# EAGLE design scienceWing (EAGLE 6.6.0)
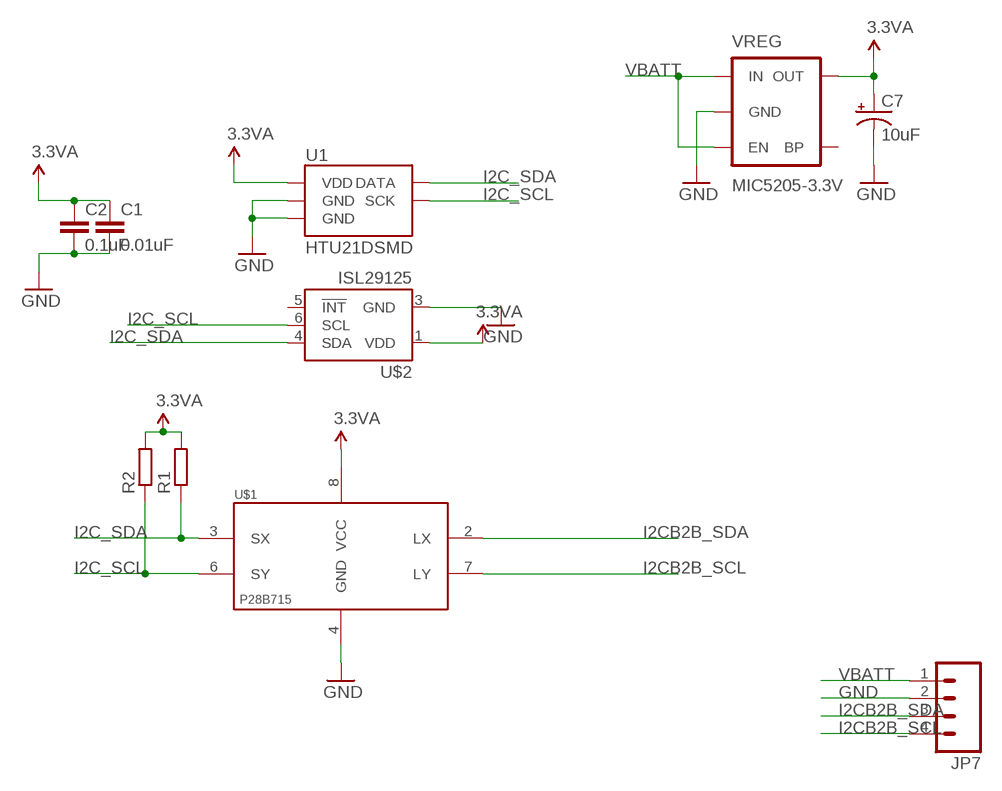
[diagram p0: schematic, sheet 1]

## Parts
C1  0.01uF  C0603  [C0603]
C2  0.1uF  C0603  [C0603]
C7  10uF  CAP_POL1206  [EIA3216]
JP7  M04JST  [1X04-1.5MM_JST]
R1  R0603  [R0603]
R2  R0603  [R0603]
U1  HTU21DSMD  [HTU21D]
U$1  P82B715  [SO8]
U$2  ISL29125  [ODFN-LD-6]
VREG  MIC5205-3.3V  V_REG_LDOSMD  [SOT23-5]

## Nets
GND: C1.2 C2.2 C7.C(-) JP7.2 U1.7(GND) U1.GND U$1.4(GND) U$2.3(GND) VREG.2(GND)
I2C_SCL: R2.1 U1.SCK U$1.6(SY) U$2.6(SCL)
I2C_SDA: R1.1 U1.DATA U$1.3(SX) U$2.4(SDA)
I2CB2B_SCL: JP7.4 U$1.7(LY)
I2CB2B_SDA: JP7.3 U$1.2(LX)
VBATT: JP7.1 VREG.1(IN) VREG.3(EN)
VCC: C1.1 C2.1 C7.A(+) R1.2 R2.2 U1.VDD U$1.8(VCC) U$2.1(VDD) VREG.5(OUT) ; supply symbol labelled 3.3VA
Unconnected: U$2.5(!INT) VREG.4(BP)

## Library data of the parts
C1 C2 = ELL-i-Passives:C: Surface Mount Capasitors — in standard sizes A capacitor used to store energy electrostatically in an electric field. If you need a high-value capacitor, consider using a polarised capacitor to save space. Wikipedia article on capacitors <https://en.wikipedia.org/wiki/Capacitor>
C7 = SparkFun-Capacitors:CAP_POL: Capacitor Polarized These are standard SMD and PTH capacitors. Normally 10uF, 47uF, and 100uF in electrolytic and tantalum varieties. Always verify the external diameter of the through hole cap, it varies with capacity, voltage, and manufacturer. The EIA devices should be standard.
JP7 = SparkFun-Connectors:M04: Header 4 Standard 4-pin 0.1" header. Use with straight break away headers (SKU : PRT-00116), right angle break away headers (PRT-00553), swiss pins (PRT-00743), machine pins (PRT-00117), and female headers (PRT-00115). Molex polarized connector foot print use with SKU : PRT-08231 with associated crimp pins and housings. 1MM SMD Version SKU: PRT-10208; OC_NEWARK: unknown
R1 R2 = ELL-i-Passives:R: Surface Mount Resistor — in standard sizes
U1 = SparkFun-Sensors:HTU21D
U$1 = Sensors:P82B715
U$2 = SparkFun-Sensors:ISL29125: The ISL29125 is a low power, high sensitivity RGB color light sensor with an I2C interface.
VREG = SparkFun:V_REG_LDO: Voltage Regulator LDO Standard 150mA LDO voltage regulator in SOT-23 layout. Micrel part MIC5205. BP (by-pass) pin is used to lower output noise with 470pF cap.

## Board
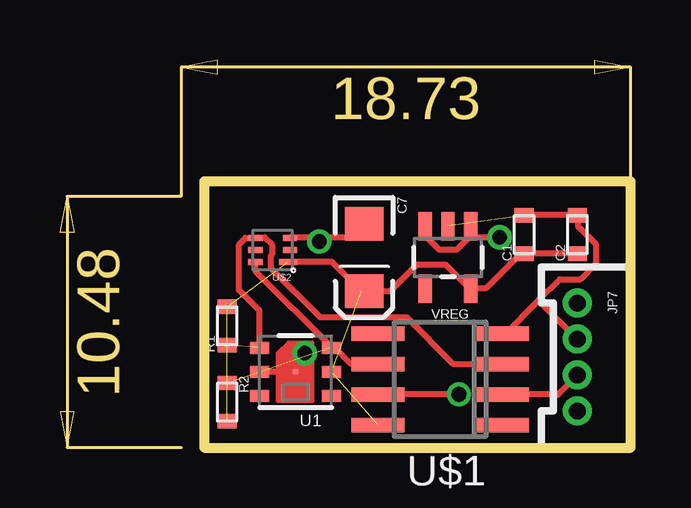
[diagram p1: board, top side]
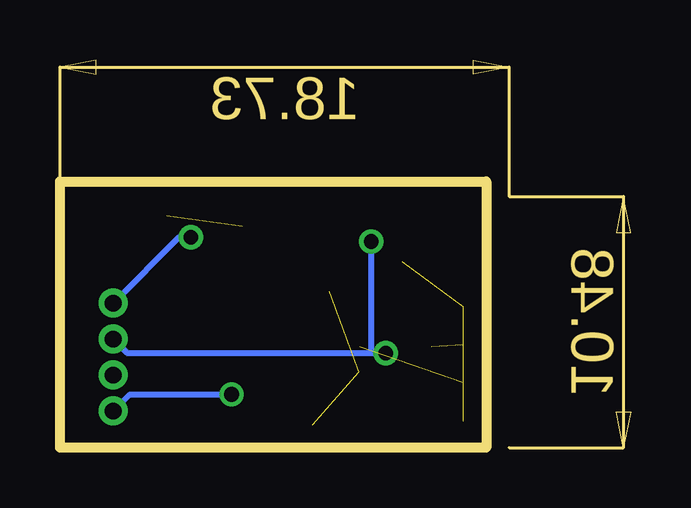
[diagram p2: board, bottom side, seen from below]

Size 17.78 x 11.11 mm. Coordinates in mm from the lower left corner, seen from the top.
Outline: 0,0 17.78,0 17.78,11.11 0,11.11 0,0
Copper layers (1*16): Top 0.035mm / dielectric 1.5mm / Bottom 0.035mm
Design rules "default": minimum track width 10mil, minimum drill 24mil, track to track 8mil, track to pad 8mil, pad to pad 8mil, via to via 8mil, smd to smd 8mil, copper to edge 40mil, drill to drill 8mil, minimum pad ring 10mil, minimum via ring 8mil, stop-mask expansion 4mil, vias tented up to drill 0mil, thermal gap 10mil

### Footprints (pad centres in the part's own frame; a part is rotated, then mirrored left to right if it is on the bottom)
C0603 = smd 0.6 x 0.8: 1 -0.8,0; 2 0.8,0
EIA3216 = smd 1.4 x 1.6: A 1.4,0; C -1.4,0
1X04-1.5MM_JST = drill 0.7: 1 0,0; 2 1.5,0; 3 3,0; 4 4.5,0
R0603 = smd 0.6 x 0.8: 1 -0.8,0; 2 0.8,0
HTU21D = smd 0.2 x 0.2: 7 0,0 | smd 0.8 x 0.5: DATA 1.5,-1; GND 1.5,0; NC@1 -1.5,1; NC@6 1.5,1; SCK -1.5,-1; VDD -1.5,0
SO8 = smd 0.6 x 2.2: 1 -1.905,-2.6; 2 -0.635,-2.6; 3 0.635,-2.6; 4 1.905,-2.6; 5 1.905,2.6; 6 0.635,2.6; 7 -0.635,2.6; 8 -1.905,2.6
ODFN-LD-6 = smd 0.75 x 0.25: 1 -0.645,0.5 | smd 0.6 x 0.25: 2 -0.72,0; 3 -0.72,-0.5; 4 0.72,-0.5; 5 0.72,0; 6 0.72,0.5
SOT23-5 = smd 0.55 x 1.2: 1 -0.95,-1.3; 2 0,-1.3; 3 0.95,-1.3; 4 0.95,1.3; 5 -0.95,1.3

### Placement (x,y rotation side)
C1  13.33,8.89 90 top
C2  15.56,8.89 90 top
C7  6.67,7.94 270 top
JP7  15.56,6.03 270 top
R1  0.95,5.08 90 top
R2  0.95,1.91 270 top
U1  3.81,3.17 180 top
U$1  9.84,2.86 90 top
U$2  2.86,8.26 180 top
VREG  10.16,7.94 180 top

### Tracks (layer width: path | path; a pad name or v marks a point on that pad's centre or on a via)
GND  (via drill 0.61)  (1 unrouted)
  Top 0.254: C1.2 C2.2 15.6,9.57 15.6,9.22 16.35,8.47 16.35,7.7 15.67,7.03 14.82,7.03 13.93,6.14 | 13.93,6.14 12.55,4.75 U$1.4 | 4.8,8.78 6,8.78 6.55,9.32 6.65,9.32 C7.C | 4.8,8.78 3.6,8.78 U$2.3 | U1.7 U1.GND | U1.7 | v4.2,3.95 3.85,3.6 3.85,3.3 U1.7 | v4.8,8.6 4.8,8.78 | 13.93,6.14 JP7.2
  Bottom 0.254: 4.8,3.95 14.97,3.95 JP7.2 | 4.8,3.95 v4.2,3.95 | 4.8,3.95 v4.8,8.6
I2C_SCL  (1 unrouted)
  Top 0.254: U$2.6 2.15,7.35 5.3,4.2 U1.SCK 5.42,4.2 6.12,3.5 7.22,3.5 U$1.6
I2C_SDA  (1 unrouted)
  Top 0.254: U1.DATA 2.3,4.2 2.3,5.72 1.45,6.58 1.45,8.47 1.72,8.75 2.12,8.75 U$2.4 2.25,8.78 2.52,8.78 2.82,8.47 2.82,8.05 2.77,8 2.77,7.5 4.82,5.45 8.42,5.45 10.37,3.5 12.42,3.5 U$1.3
I2CB2B_SCL  (via drill 0.61)
  Top 0.254: v10.62,2.23 U$1.7
  Bottom 0.254: v10.62,2.23 14.87,2.23 15.55,1.55 JP7.4
I2CB2B_SDA
  Top 0.254: U$1.2 14.75,2.23 JP7.3
VBATT  (via drill 0.61)
  Top 0.254: VREG.3 9.2,9.22 9.2,8.85 9.8,8.25 10.52,8.25 11.1,8.82 11.1,9.22 VREG.1 11.22,8.78 v12.32,8.78
  Bottom 0.254: v12.32,8.78 12.82,8.78 15.55,6.05 JP7.1
VCC  (4 unrouted)
  Top 0.254: U$2.1 3.52,7.75 5.32,7.75 6.55,6.53 6.65,6.53 C7.A 6.77,6.53 7.75,6.53 8.85,7.62 10.07,7.62 11,6.7 VREG.5 11.12,6.65 11.75,6.65 13.22,8.12 C1.1 C2.1